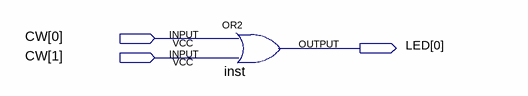
[diagram p0: schematic sheet]
// Quartus schematic ex1.bdf as structural Verilog: 1 symbols, 3 pins
module ex1 (
  input  [1:0] CW,
  output [0:0] LED
);

  or inst (LED[0], CW[0], CW[1]);
endmodule
